# Altium project Hub Board.PrjPcb
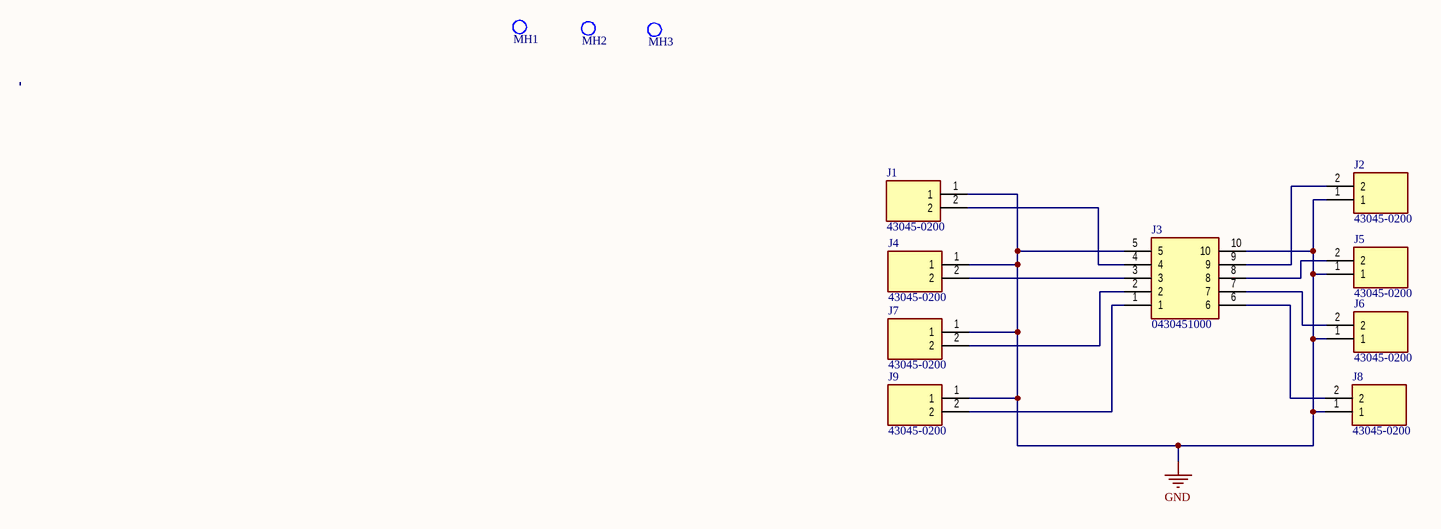
[diagram p0: HubBoard.SchDoc]
1 sheet, 12 parts. Net scope: global (net labels, ports and power ports of the same name join across sheets).
Board file: HubBoard.PcbDoc

## Sheet HubBoard.SchDoc
size 431 x 279 mm; SheetNumber: 1; SheetTotal: 1; ENG_APP_DATE: --/--/--; DSN_APP_DATE: --/--/--; CHK_APP_DATE: --/--/--

### Parts
J1  43045-0200  [43045-0200]
J2  43045-0200  [43045-0200]
J3  0430451000  [0430451000]
J4  43045-0200  [43045-0200]
J5  43045-0200  [43045-0200]
J6  43045-0200  [43045-0200]
J7  43045-0200  [43045-0200]
J8  43045-0200  [43045-0200]
J9  43045-0200  [43045-0200]
MH1  Mounting Hole  [MOUNT-HOLE]  (value not drawn)  (no BOM)
MH2  Mounting Hole  [MOUNT-HOLE]  (value not drawn)  (no BOM)
MH3  Mounting Hole  [MOUNT-HOLE]  (value not drawn)  (no BOM)

### Nets
GND: J1.1 J2.1 J3.5 J3.10 J4.1 J5.1 J6.1 J7.1 J8.1 J9.1
NetJ1_2: J1.2 J3.4
NetJ2_2: J2.2 J3.9
NetJ3_1: J3.1 J9.2
NetJ3_2: J3.2 J7.2
NetJ3_3: J3.3 J4.2
NetJ3_6: J3.6 J8.2
NetJ3_7: J3.7 J6.2
NetJ3_8: J3.8 J5.2

### Notes on the sheet
- 8
- 7
- 6
- 5
- 4
- 3
- DWG. NO.
- REV.
- SHT.
- 2
- 1
- THIS DOCUMENT AND THE DATA DISCLOSED HEREIN OR HEREWITH IS THE PROPERTY OF ALTIUM LIMITED AND MAY BE FREELY DISTRIBUTED IN WHOLE. NO RIGHTS ARE RESERVED OR EXPRESS OR IMPLIED WARANTEE GIVEN.
- REVISION
- DESCRIPTION
- DATE
- APPROVED
- F
- E
- D
- C
- B
- ENG:
- APPROVALS
- PROJECT
- SUITE 200
- 2175 SALK AVENUE
- CARLSBAD, CA 92008
- A
- DSN:
- CHK:
- REFERENCE DOCUMENTS
- PROJECT REVISION:
- TITLE
- DOCUMENT REVISION:
- DESIGN ITEM:
- USA
- BOM:
- FAB DWG:
- PCB DWG:
- ASSY DWG:
- SCALE:
- SIZE
- CAGE CODE
- FILE NAME
- DWG NO.
- SHEET
- OF
- REV

### Library data of the parts
J1 J2 J4-J9 = 43045-0200: Connector; Manufacturer_Name: Molex; Datasheet Link: http://www.molex.com/webdocs/datasheets/pdf/en-us/0430450200_PCB_HEADERS.pdf; Manufacturer_Part_Number: 43045-0200; Mouser Part Number: 538-43045-0200; Mouser Price/Stock: https://www.mouser.co.uk/ProductDetail/Molex/43045-0200?qs=4XSMV6Twtb0Q814SQfY6cQ%3D%3D
J3 = 0430451000: Connector; Manufacturer_Name: Molex; Datasheet Link: https://www.molex.com/pdm_docs/sd/430451000_sd.pdf; Height: 9.02mm; Manufacturer_Part_Number: 0430451000; Arrow Part Number: 0430451000; Arrow Price/Stock: https://www.arrow.com/en/products/0430451000/molex
MH1-MH3 = Mounting Hole: #4 Screw, 0.116in Diameter